# Altium project Barbarov_Guc_Dagitim_karti.PrjPcb
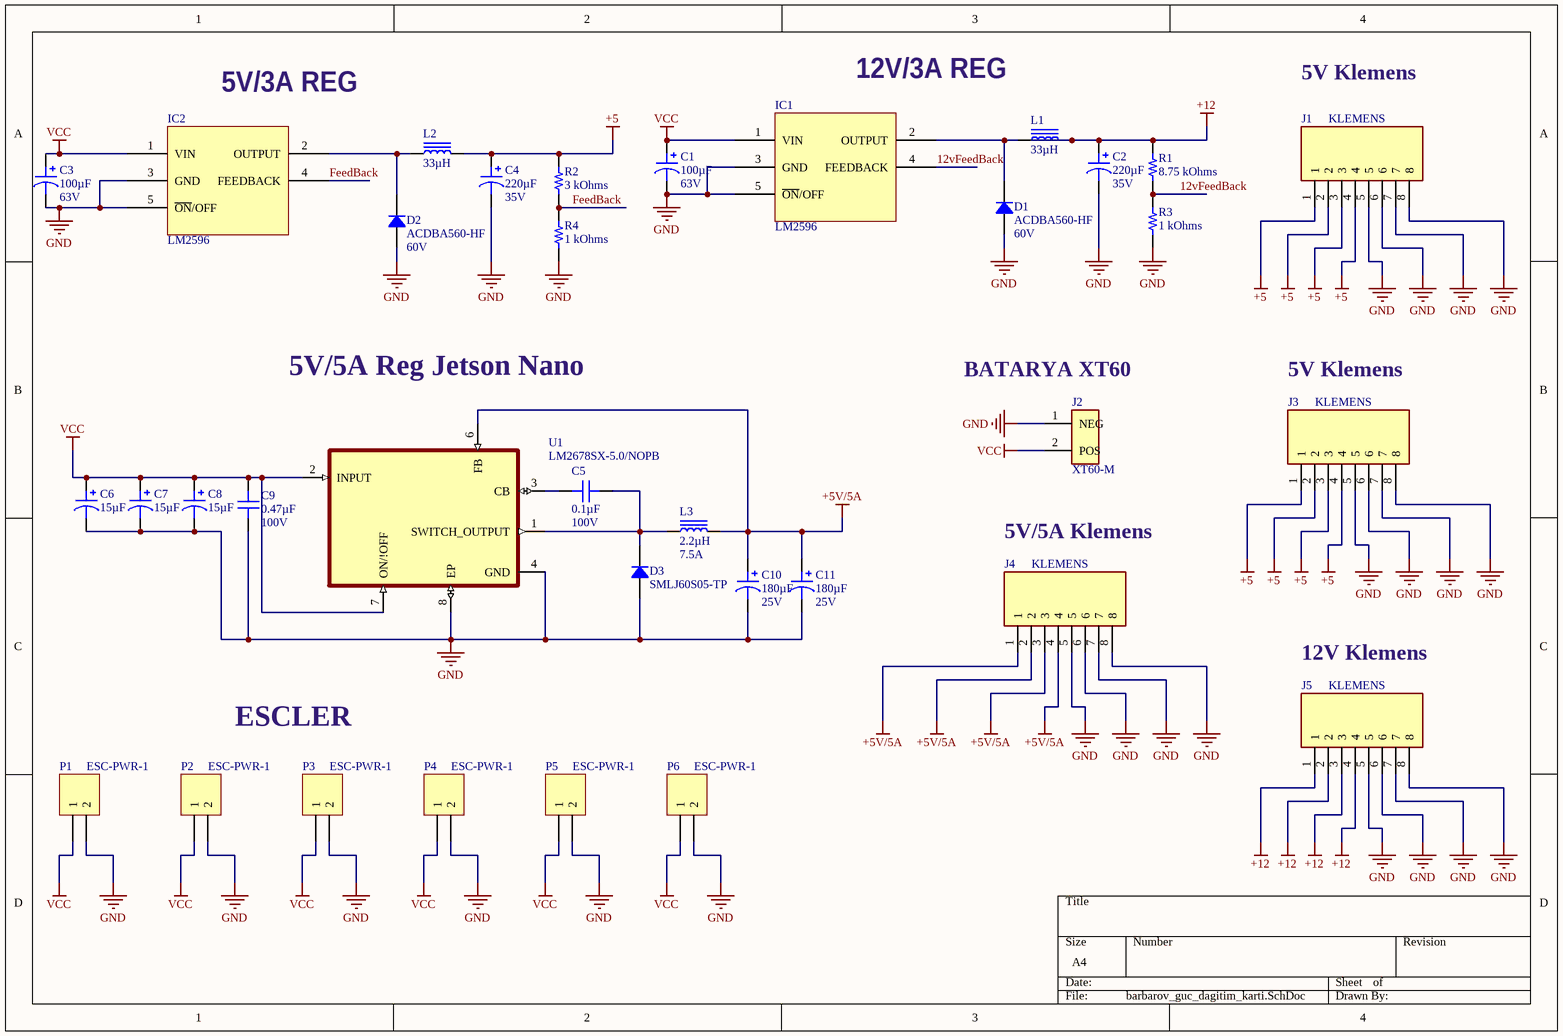
[diagram p0: barbarov_guc_dagitim_karti.SchDoc]
1 sheet, 35 parts. Net scope: global (net labels, ports and power ports of the same name join across sheets).
Board file: barbarov_guc_dagitim_karti.PcbDoc

## Sheet barbarov_guc_dagitim_karti.SchDoc
size A4; SheetNumber: 1; SheetTotal: 1

### Parts
C1  100µF  Voltage - Rated: 63V  [CAP TH ALUM ELEC D8.00mm S3.50mm H12.50mm]
C2  220µF  Voltage - Rated: 35V  [CAP TH ALUM ELEC D8.00mm S3.50mm H12.50mm]
C3  100µF  Voltage - Rated: 63V  [CAP TH ALUM ELEC D8.00mm S3.50mm H12.50mm]
C4  220µF  Voltage - Rated: 35V  [CAP TH ALUM ELEC D8.00mm S3.50mm H12.50mm]
C5  Voltage - Rated: 100V  [CAP 1206_3216 - 1.8MM]  (hidden comment: 0.1µF)
C6  15µF  [CAP TH ALUM ELEC D8.00mm S3.50mm H11.50mm]
C7  15µF  [CAP TH ALUM ELEC D8.00mm S3.50mm H11.50mm]
C8  15µF  [CAP TH ALUM ELEC D8.00mm S3.50mm H11.50mm]
C9  Voltage - Rated: 100V  [CAP 1206_3216 - 1.8MM]  (hidden comment: 0.47µF)
C10  180µF  Voltage - Rated: 25V  [CAP TH ALUM ELEC D8.00mm S3.50mm H13.00mm]
C11  180µF  Voltage - Rated: 25V  [CAP TH ALUM ELEC D8.00mm S3.50mm H13.00mm]
D1  ACDBA560-HF  Voltage - DC Reverse (Vr) (Max): 60V  [DO214AC SMA]
D2  ACDBA560-HF  Voltage - DC Reverse (Vr) (Max): 60V  [DO214AC SMA]
D3  SMLJ60S05-TP  [DO214AB SMC]
IC1  LM2596  [D2PAK]
IC2  LM2596  [D2PAK]
J1  KLEMENS  [TE_284512-8]
J2  XT60-M  [AMASS_XT60-M]
J3  KLEMENS  [TE_284512-8]
J4  KLEMENS  [TE_284512-8]
J5  KLEMENS  [TE_284512-8]
L1  33µH  [BOURNS SRR1280]
L2  33µH  [BOURNS SRR1280]
L3  2.2µH  Current Rating (Amps): 7.5A  [WURTH 5040]
P1  ESC-PWR-1  [HDR1X2]
P2  ESC-PWR-1  [HDR1X2]
P3  ESC-PWR-1  [HDR1X2]
P4  ESC-PWR-1  [HDR1X2]
P5  ESC-PWR-1  [HDR1X2]
P6  ESC-PWR-1  [HDR1X2]
R1  8.75 kOhms  [RES 0805_2012]
R2  3 kOhms  [RES 0805_2012]
R3  1 kOhms  [RES 0805_2012]
R4  1 kOhms  [RES 0805_2012]
U1  LM2678SX-5.0/NOPB  [TO127P1435X464-8N]

### Nets
+5: C4.1 J1.1 J1.2 J1.3 J1.4 J3.1 J3.2 J3.3 J3.4 L2.2 R2.2
+5V/5A: C10.1 C11.1 J4.1 J4.2 J4.3 J4.4 L3.2 U1.6(FB)
+12: C2.1 J5.1 J5.2 J5.3 J5.4 L1.2 R1.2
GND: C1.2 C2.2 C3.2 C4.2 C6.2 C7.2 C8.2 C9.1 C10.2 C11.2 D1.1 D2.1 D3.1 IC1.3(GND) IC1.5(~{ON}/OFF) IC2.3(GND) IC2.5(~{ON}/OFF) J1.5 J1.6 J1.7 J1.8 J2.1(NEG) J3.5 J3.6 J3.7 J3.8 J4.5 J4.6 J4.7 J4.8 J5.5 J5.6 J5.7 J5.8 P1.2 P2.2 P3.2 P4.2 P5.2 P6.2 R3.1 R4.1 U1.4(GND) U1.8(EP)
VCC: C1.1 C3.1 C6.1 C7.1 C8.1 C9.2 IC1.1(VIN) IC2.1(VIN) J2.2(POS) P1.1 P2.1 P3.1 P4.1 P5.1 P6.1 U1.2(INPUT) U1.7(ON/!OFF)
12vFeedBack: IC1.4(FEEDBACK) R1.1 R3.2
FeedBack: IC2.4(FEEDBACK) R2.1 R4.2
NetC5_1: C5.1 D3.2 L3.1 U1.1(SWITCH_OUTPUT)
NetC5_2: C5.2 U1.3(CB)
NetD1_2: D1.2 IC1.2(OUTPUT) L1.1
NetD2_2: D2.2 IC2.2(OUTPUT) L2.1

### Notes on the sheet
- 5V/3A REG
- 12V/3A REG
- 5V Klemens
- 5V/5A Reg Jetson Nano
- (near J2) BATARYA XT60
- 5V/5A Klemens
- 12V Klemens
- ESCLER

### Library data of the parts
C1 C3 = ECA-1JM101: CAP ALUM 100UF 20% 63V RADIAL; Manufacturer: Panasonic Electronic Components; Lifetime @ Temp.: 2000 Hrs @ 85°C; Polarization: Polar; Ripple Current @ High Frequency: 459mA @ 10kHz; Ripple Current @ Low Frequency: 270mA @ 120Hz; Part Number: ECA-1JM101; Applications: General Purpose; Capacitance: 100µF; ComponentLink1Description: Datasheet; ComponentLink1URL: //media.digikey.com/pdf/Data%20Sheets/Panasonic%20Electronic%20Components/ECA-xxM%20Series,TypeA.pdf; ComponentLink2Description: DigiKey Link; ComponentLink2URL: http://digikey.com/product-detail/en/panasonic-electronic-components/ECA-1JM101/P5193-ND/245052; Device Package: Radial, Can; Height - Seated (Max): 0.492" (12.50mm); LastUpdated: 2020-09-07 05:24:51; Lead Spacing: 0.138" (3.50mm); Lifecycle Status: Active; Minimum Order: 1; Mounting Type: Through Hole; Operating Temperature: -40°C ~ 85°C; Package / Case: Radial, Can; Packaging: Bulk; PartId: 7225; Part Status: Active; Price: 0.37; Series: M; Size / Dimension: 0.315" Dia (8.00mm); Supplier 1: DigiKey; Supplier Part Number 1: P5193-ND; Tolerance: ±20%; Value: 100µF
C2 C4 = ECA-1VM221: CAP ALUM 220UF 20% 35V RADIAL; Manufacturer: Panasonic Electronic Components; Lifetime @ Temp.: 2000 Hrs @ 85°C; Polarization: Polar; Ripple Current @ High Frequency: 595mA @ 10kHz; Ripple Current @ Low Frequency: 350mA @ 120Hz; Part Number: ECA-1VM221; Applications: General Purpose; Capacitance: 220µF; ComponentLink1Description: Datasheet; ComponentLink1URL: //media.digikey.com/pdf/Data%20Sheets/Panasonic%20Electronic%20Components/ECA-xxM%20Series,TypeA.pdf; ComponentLink2Description: DigiKey Link; ComponentLink2URL: http://digikey.com/product-detail/en/panasonic-electronic-components/ECA-1VM221/P5166-ND/245025; Device Package: Radial, Can; Height - Seated (Max): 0.492" (12.50mm); LastUpdated: 2020-09-07 05:24:51; Lead Spacing: 0.138" (3.50mm); Lifecycle Status: Active; Minimum Order: 1; Mounting Type: Through Hole; Operating Temperature: -40°C ~ 85°C; Package / Case: Radial, Can; Packaging: Bulk; PartId: 7280; Part Status: Active; Price: 0.31; Series: M; Size / Dimension: 0.315" Dia (8.00mm); Supplier 1: DigiKey; Supplier Part Number 1: P5166-ND; Tolerance: ±20%; Value: 220µF
C5 = C3216X7R2A474K160AE: CAP CER 0.47UF 100V X7R 1206; Manufacturer: TDK Corporation; Capacitance: 0.47µF; Tolerance: ±10%; Part Number: C3216X7R2A474K160AE; Value: 0.1µF; Applications: Boardflex Sensitive; ComponentLink1Description: Datasheet; ComponentLink1URL: https://product.tdk.com/info/en/catalog/datasheets/mlcc_commercial_soft_en.pdf?ref_disty=digikey; ComponentLink2Description: DigiKey Link; ComponentLink2URL: http://digikey.com/product-detail/en/tdk-corporation/C3216X7R2A474K160AE/445-8902-1-ND/3283711; Device Package: 1206 (3216 Metric); Features: Soft Termination; LastUpdated: 2.09.2020 01:05:29; Lifecycle Status: Active; Minimum Order: 1; Mounting Type: Surface Mount, MLCC; Operating Temperature: -55°C ~ 125°C; Package / Case: 1206 (3216 Metric); Packaging: TapeAndReel; PartId: 22076; Part Status: Active; Price: 0.22; Series: C; Size / Dimension: 0.126" L x 0.063" W (3.20mm x 1.60mm); Supplier 1: DigiKey; Supplier Part Number 1: 445-8902-1-ND; Temperature Coefficient: X7R; Thickness (Max): 0.063" (1.60mm)
C6-C8 = UPW2A150MPD: CAP ALUM 15UF 20% 100V RADIAL; Manufacturer: Nichicon; Impedance: 830 mOhms; Lifetime @ Temp.: 3000 Hrs @ 105°C; Polarization: Polar; Ripple Current @ High Frequency: 180mA @ 100kHz; Ripple Current @ Low Frequency: 54mA @ 120Hz; Part Number: UPW2A150MPD; Applications: General Purpose; Capacitance: 15µF; ComponentLink1Description: Datasheet; ComponentLink1URL: http://nichicon-us.com/english/products/pdfs/e-upw.pdf; ComponentLink2Description: DigiKey Link; ComponentLink2URL: http://digikey.com/product-detail/en/nichicon/UPW2A150MPD/493-1968-ND/589709; Device Package: Radial, Can; Height - Seated (Max): 0.453" (11.50mm); LastUpdated: 7.09.2020 05:24:50; Lead Spacing: 0.138" (3.50mm); Lifecycle Status: Active; Minimum Order: 1; Mounting Type: Through Hole; Operating Temperature: -55°C ~ 105°C; Package / Case: Radial, Can; Packaging: Bulk; PartId: 23526; Part Status: Active; Price: 0.39; Series: UPW; Size / Dimension: 0.315" Dia (8.00mm); Supplier 1: DigiKey; Supplier Part Number 1: 493-1968-ND; Tolerance: ±20%; Value: 15µF; Voltage - Rated: 100V
C9 = C3216X7R2A474K160AE: CAP CER 0.47UF 100V X7R 1206; Manufacturer: TDK Corporation; Tolerance: ±10%; Part Number: C3216X7R2A474K160AE; Value: 0.47µF; Applications: Boardflex Sensitive; Capacitance: 0.47µF; ComponentLink1Description: Datasheet; ComponentLink1URL: https://product.tdk.com/info/en/catalog/datasheets/mlcc_commercial_soft_en.pdf?ref_disty=digikey; ComponentLink2Description: DigiKey Link; ComponentLink2URL: http://digikey.com/product-detail/en/tdk-corporation/C3216X7R2A474K160AE/445-8902-1-ND/3283711; Device Package: 1206 (3216 Metric); Features: Soft Termination; LastUpdated: 2.09.2020 01:05:29; Lifecycle Status: Active; Minimum Order: 1; Mounting Type: Surface Mount, MLCC; Operating Temperature: -55°C ~ 125°C; Package / Case: 1206 (3216 Metric); Packaging: TapeAndReel; PartId: 22076; Part Status: Active; Price: 0.22; Series: C; Size / Dimension: 0.126" L x 0.063" W (3.20mm x 1.60mm); Supplier 1: DigiKey; Supplier Part Number 1: 445-8902-1-ND; Temperature Coefficient: X7R; Thickness (Max): 0.063" (1.60mm)
C10 C11 = 860080474009: CAP ALUM 180UF 20% 25V THRU HOLE; Manufacturer: Würth Elektronik; Impedance: 98 mOhms; Lifetime @ Temp.: 3000 Hrs @ 105°C; Polarization: Polar; Ripple Current @ High Frequency: 620mA @ 100kHz; Part Number: 860080474009; Applications: General Purpose; Capacitance: 180µF; ComponentLink1Description: Datasheet; ComponentLink1URL: https://katalog.we-online.de/pbs/datasheet/860080474009.pdf; ComponentLink2Description: DigiKey Link; ComponentLink2URL: http://digikey.com/product-detail/en/w-rth-elektronik/860080474009/732-9025-1-ND/5728968; Device Package: Radial, Can; Height - Seated (Max): 0.512" (13.00mm); LastUpdated: 7.09.2020 05:24:55; Lead Spacing: 0.138" (3.50mm); Lifecycle Status: Active; Minimum Order: 1; Mounting Type: Through Hole; Operating Temperature: -55°C ~ 105°C; Package / Case: Radial, Can; Packaging: TapeAndBox; PartId: 24217; Part Status: Active; Price: 0.15; Series: WCAP-ATLI; Size / Dimension: 0.315" Dia (8.00mm); Supplier 1: DigiKey; Supplier Part Number 1: 732-9025-1-ND; Tolerance: ±20%; Value: 180µF
D1 D2 = ACDBA560-HF: DIODE SCHOTTKY 60V 5A DO214AC; Manufacturer: Comchip Technology; Capacitance @ Vr, F: 250pF @ 4V, 1MHz; Current - Average Rectified (Io): 5A (DC); Current - Reverse Leakage @ Vr: 500µA @ 60V; Speed: Fast Recovery =< 500ns, > 200mA (Io); Voltage - Forward (Vf) (Max) @ If: 700mV @ 5A; Part Number: ACDBA560-HF; ComponentLink1Description: Datasheet; ComponentLink1URL: http://www.comchiptech.com/admin/files/product/ACDBA560-HF%20RevA201382.pdf; ComponentLink2Description: DigiKey Link; ComponentLink2URL: http://digikey.com/product-detail/en/comchip-technology/ACDBA560-HF/641-2078-1-ND/10131664; Diode Type: Schottky; LastUpdated: 2020-09-02 01:19:04; Lifecycle Status: Active; Minimum Order: 1; Mounting Type: Surface Mount; Operating Temperature - Junction: -55°C ~ 125°C; Package / Case: DO-214AC, SMA; Packaging: TapeAndReel; PartId: 1832; Part Status: Active; Price: 0.13; Series: Automotive, AEC-Q101; Supplier 1: DigiKey; Supplier Part Number 1: 641-2078-1-ND; Supplier Device Package: DO-214AC (SMA)
D3 = SMLJ60S05-TP: DIODE GEN PURP 50V 6A DO214AB; Manufacturer: Micro Commercial Co; Capacitance @ Vr, F: 150pF @ 4V, 1MHz; Current - Reverse Leakage @ Vr: 5µA @ 50V; Diode Type: Standard; Speed: Standard Recovery >500ns, > 200mA (Io); Voltage - Forward (Vf) (Max) @ If: 1V @ 6A; Part Number: SMLJ60S05-TP; ComponentLink1Description: Datasheet; ComponentLink1URL: https://www.mccsemi.com/pdf/Products/SMLJ60S05~SMLJ60S10(DO-214AB).pdf; ComponentLink2Description: DigiKey Link; ComponentLink2URL: http://digikey.com/product-detail/en/micro-commercial-co/SMLJ60S05-TP/SMLJ60S05-TPMSCT-ND/2404599; Current - Average Rectified (Io): 6A; LastUpdated: 2.09.2020 01:18:57; Lifecycle Status: Active; Minimum Order: 1; Mounting Type: Surface Mount; Operating Temperature - Junction: -55°C ~ 150°C; Package / Case: DO-214AB, SMC; Packaging: TapeAndReel; PartId: 345; Part Status: Active; Price: 0.40; Series: -; Supplier 1: DigiKey; Supplier Part Number 1: SMLJ60S05-TPMSCT-ND; Supplier Device Package: DO-214AB (SMC); Voltage - DC Reverse (Vr) (Max): 50V
J1 J3-J5 = 284512-8: 8 POS TERMI-BLOK HDR 900 POLAR; MF: TE Connectivity; Centerline_Pitch: 3.5 mm[.138 in]; Number_of_Positions: 8; SnapEDA_Link: https://www.snapeda.com/parts/284512-8/TE%20Connectivity%20AMP%20Connectors/view-part/467023/?ref=snap; MP: 284512-8; Price: None; EU_RoHS_Compliance: Compliant; Availability: Unavailable; TE_purchase_URL: https://www.te.com/usa-en/product-284512-8.html?te_bu=Cor&te_type=disp&te_campaign=seda_glo_cor-seda-global-disp-prtnr-fy19-seda-model-bom-cta_sma-317_1&elqCampaignId=32493; Value: *; Package: None
J2 = XT60-M: Plug; DC supply; XT60; male; PIN: 2; for cable; soldered; 30A; 500V; MF: AMASS; MP: XT60-M; Price: None; Package: Package Analog Devices; Value: *; Availability: Unavailable; SnapEDA_Link: https://www.snapeda.com/parts/XT60-M/AMASS/view-part/2883912/?ref=snap
L1 L2 = SRR1280-330M: FIXED IND 33UH 3.5A 57 MOHM SMD; Manufacturer: Bourns Inc.; Current - Saturation: 3.3A; DC Resistance (DCR): 57mOhm Max; Frequency - Self Resonant: 9.5MHz; Inductance Frequency - Test: 100kHz; Material - Core: Ferrite; Q @ Freq: 28 @ 2.52MHz; Shielding: Shielded; Tolerance: ±20%; Type: Wirewound; Part Number: SRR1280-330M; ComponentLink1Description: Datasheet; ComponentLink1URL: https://www.bourns.com/docs/Product-Datasheets/SRR1280.pdf; ComponentLink2Description: DigiKey Link; ComponentLink2URL: http://digikey.com/product-detail/en/bourns-inc/SRR1280-330M/SRR1280-330MCT-ND/2127440; Current Rating (Amps): 3.5A; Device Package: Nonstandard; Height - Seated (Max): 0.315" (8.00mm); Inductance: 33µH; LastUpdated: 2020-09-02 01:22:09; Lifecycle Status: Active; Minimum Order: 1; Mounting Type: Surface Mount; Operating Temperature: -40°C ~ 125°C; Package / Case: Nonstandard; Packaging: TapeAndReel; PartId: 25; Part Status: Active; Price: 0.65; Series: SRR1280; Size / Dimension: 0.492" L x 0.492" W (12.50mm x 12.50mm); Supplier 1: DigiKey; Supplier Part Number 1: SRR1280-330MCT-ND; Value: 33µH
L3 = 744316220: FIXED IND 2.2UH 7.5A 11.3 MOHM; Manufacturer: Würth Elektronik; Frequency - Self Resonant: 108MHz; Inductance Frequency - Test: 100kHz; Material - Core: 2-SMD; Shielding: Shielded; Tolerance: ±20%; Type: Wirewound; Part Number: 744316220; ComponentLink1Description: Datasheet; ComponentLink1URL: https://katalog.we-online.de/pbs/datasheet/744316220.pdf; ComponentLink2Description: DigiKey Link; ComponentLink2URL: http://digikey.com/product-detail/en/w-rth-elektronik/744316220/732-6179-1-ND/5050830; Current - Saturation: 7.5A; DC Resistance (DCR): 11.3mOhm; Height - Seated (Max): 0.169" (4.30mm); Inductance: 2.2µH; LastUpdated: 2.09.2020 01:22:18; Lifecycle Status: Active; Minimum Order: 1; Mounting Type: Surface Mount; Operating Temperature: -40°C ~ 150°C; Package / Case: 2-SMD; Packaging: TapeAndReel; PartId: 256; Part Status: Active; Price: 1.61; Ratings: AEC-Q200; Series: WE-HCI; Size / Dimension: 0.217" L x 0.209" W (5.50mm x 5.30mm); Supplier 1: DigiKey; Supplier Part Number 1: 732-6179-1-ND; Supplier Device Package: 5040; Value: 2.2µH
P1-P6 = Header 2: Header, 2-Pin; LatestRevisionDate: 17-Jul-2002; LatestRevisionNote: Re-released for DXP Platform.; Publisher: Altium Limited
R1 R2 = RNCP0805FTD10K0: RES 10K OHM 1% 1/4W 0805; Manufacturer: Stackpole Electronics Inc; Power (Watts): 0.25W, 1/4W; Resistance: 10 kOhms; Temperature Coefficient: ±100ppm/°C; Part Number: RNCP0805FTD10K0; ComponentLink1Description: Datasheet; ComponentLink1URL: https://www.seielect.com/catalog/sei-rncp.pdf; ComponentLink2Description: DigiKey Link; ComponentLink2URL: http://digikey.com/product-detail/en/stackpole-electronics-inc/RNCP0805FTD10K0/RNCP0805FTD10K0CT-ND/2240601; Composition: Thin Film; Device Package: 0805 (2012 Metric); Features: Anti-Sulfur, Moisture Resistant; Height - Seated (Max): 0.024" (0.60mm); LastUpdated: 2020-09-02 01:15:23; Lifecycle Status: Active; Minimum Order: 1; Number of Terminations: 2; Operating Temperature: -55°C ~ 155°C; Package / Case: 0805 (2012 Metric); Packaging: TapeAndReel; PartId: 28021; Part Status: Active; Price: 0.01; Series: RNCP; Size / Dimension: 0.079" L x 0.049" W (2.00mm x 1.25mm); Supplier 1: DigiKey; Supplier Part Number 1: RNCP0805FTD10K0CT-ND; Supplier Device Package: 0805; Tolerance: ±1%
  R1: Value: 8.75 kOhms
  R2: Value: 3 kOhms
R3 R4 = CRGP0805F4K7: CRGP 0805 4K7 1%; Manufacturer: TE Connectivity Passive Product; Power (Watts): 0.333W, 1/3W; Resistance: 4.7 kOhms; Temperature Coefficient: ±100ppm/°C; Part Number: CRGP0805F4K7; Value: 1 kOhms; ComponentLink1Description: Datasheet; ComponentLink1URL: https://www.te.com/commerce/DocumentDelivery/DDEController?Action=srchrtrv&DocNm=9-1773463-9&DocType=DS&DocLang=English; ComponentLink2Description: DigiKey Link; ComponentLink2URL: http://digikey.com/product-detail/en/te-connectivity-passive-product/CRGP0805F4K7/A130485CT-ND/8578317; Composition: Thick Film; Device Package: 0805 (2012 Metric); Features: Pulse Withstanding; Height - Seated (Max): 0.026" (0.65mm); LastUpdated: 2020-09-02 01:15:22; Lifecycle Status: Active; Minimum Order: 1; Number of Terminations: 2; Operating Temperature: -55°C ~ 155°C; Package / Case: 0805 (2012 Metric); Packaging: TapeAndReel; PartId: 28726; Part Status: Active; Price: 0.02; Series: CRGP; Size / Dimension: 0.079" L x 0.049" W (2.00mm x 1.25mm); Supplier 1: DigiKey; Supplier Part Number 1: A130485CT-ND; Supplier Device Package: 0805; Tolerance: ±1%
U1 = LM2678SX-5.0/NOPB: 8V to 40V, 5A SIMPLE SWITCHER buck converter with high efficiency 7-DDPAK/TO-263 -40 to 125; MF: Texas Instruments; SnapEDA_Link: https://www.snapeda.com/parts/LM2678SX-5.0/NOPB/Texas%20Instruments/view-part/1219450/?ref=snap; MP: LM2678SX-5.0/NOPB; Value: *; Purchase-URL: https://pricing.snapeda.com/search/part/LM2678SX-5.0/NOPB/?ref=eda; Package: TO-263-7 Texas Instruments; Check_prices: https://www.snapeda.com/parts/LM2678SX-5.0/NOPB/Texas%20Instruments/view-part/1219450/?ref=eda; Digi-Key_Part_Number: LM2678SX-5.0/NOPBCT-ND